# Altium schematic sheet Motor.SchDoc
size A4; SheetNumber: 3; SheetTotal: 4
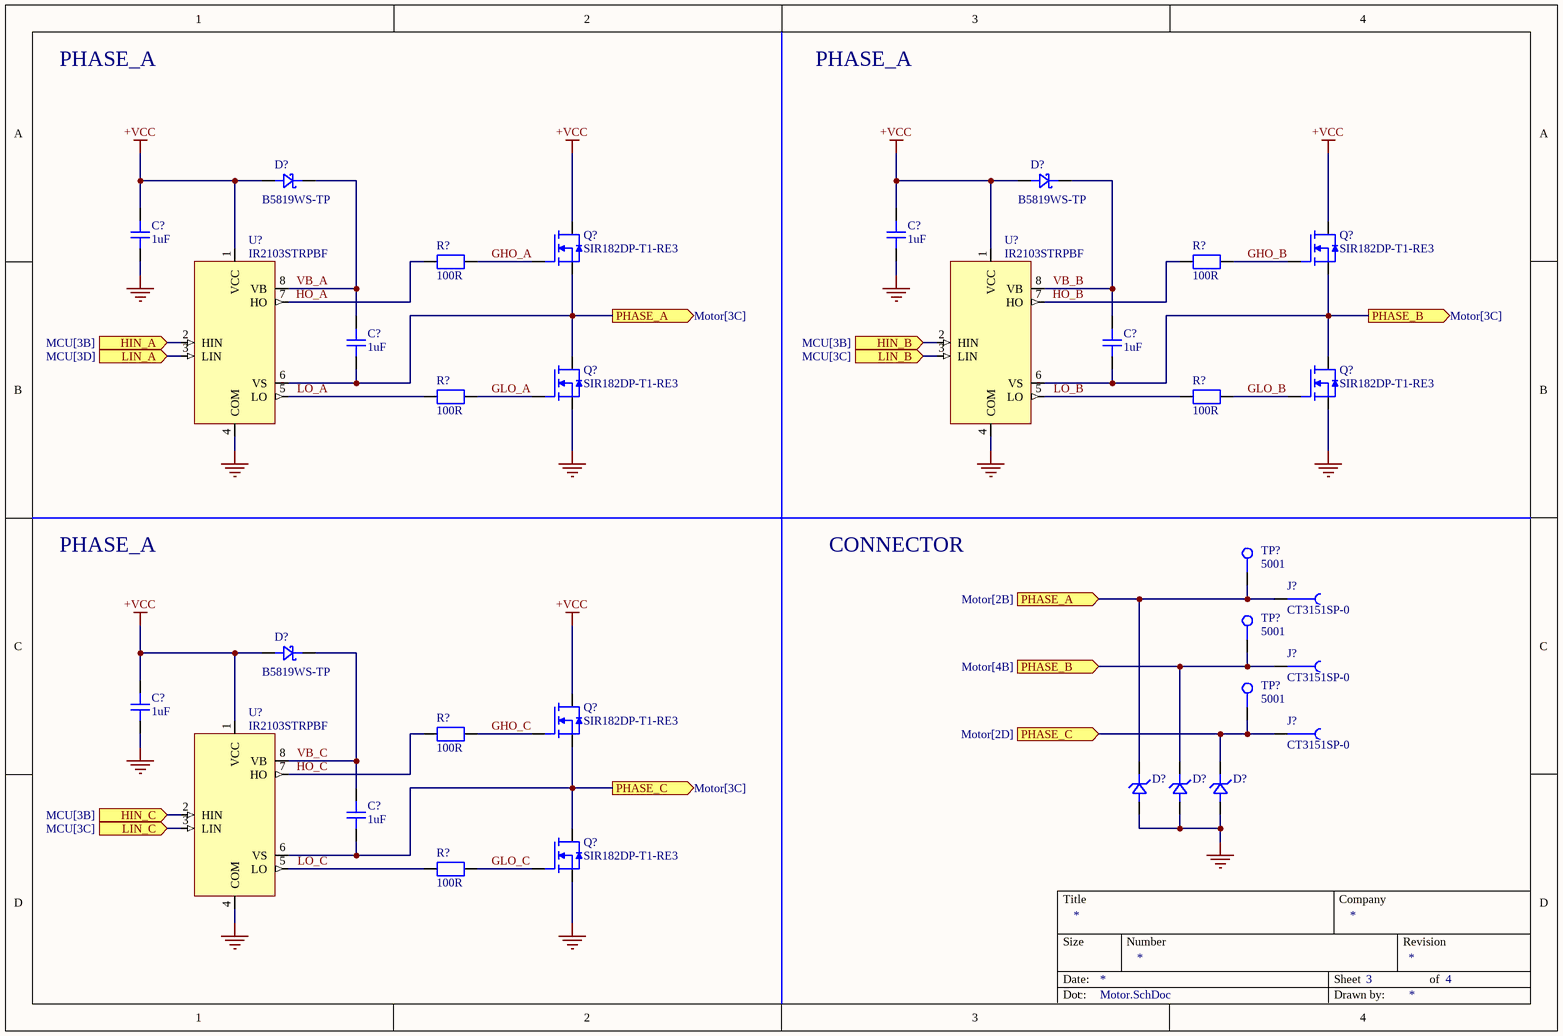
[diagram p0: Motor.SchDoc]

## Parts
(Parts that share a designator on the sheet are numbered #1, #2 ... from top to bottom, then left to right.)
C?#1  value 1uF  [C_Yageo_CC_0603_A]  (hidden comment: CC0603KRX7R7BB105)
C?#2  value 1uF  [C_Yageo_CC_0603_A]  (hidden comment: CC0603KRX7R7BB105)
C?#3  value 1uF  [C_Yageo_CC_0603_A]  (hidden comment: CC0603KRX7R7BB105)
C?#4  value 1uF  [C_Yageo_CC_0603_A]  (hidden comment: CC0603KRX7R7BB105)
C?#5  value 1uF  [C_Yageo_CC_0603_A]  (hidden comment: CC0603KRX7R7BB105)
C?#6  value 1uF  [C_Yageo_CC_0603_A]  (hidden comment: CC0603KRX7R7BB105)
D?#1  B5819WS-TP  [D_Schottky_Micro_SOD-323]
D?#2  B5819WS-TP  [D_Schottky_Micro_SOD-323]
D?#3  B5819WS-TP  [D_Schottky_Micro_SOD-323]
D?#4  D5V0F1U2S9-7  [D_TVS_Uni_Diodes_SOD-923_B]  (value not drawn)
D?#5  D5V0F1U2S9-7  [D_TVS_Uni_Diodes_SOD-923_B]  (value not drawn)
D?#6  D5V0F1U2S9-7  [D_TVS_Uni_Diodes_SOD-923_B]  (value not drawn)
J?#1  CT3151SP-0  [J_CalTest_CT3151SP-0]
J?#2  CT3151SP-0  [J_CalTest_CT3151SP-0]
J?#3  CT3151SP-0  [J_CalTest_CT3151SP-0]
Q?#1  SIR182DP-T1-RE3  [Q_Vishay_PowerPACK-SO-8-Single]
Q?#2  SIR182DP-T1-RE3  [Q_Vishay_PowerPACK-SO-8-Single]
Q?#3  SIR182DP-T1-RE3  [Q_Vishay_PowerPACK-SO-8-Single]
Q?#4  SIR182DP-T1-RE3  [Q_Vishay_PowerPACK-SO-8-Single]
Q?#5  SIR182DP-T1-RE3  [Q_Vishay_PowerPACK-SO-8-Single]
Q?#6  SIR182DP-T1-RE3  [Q_Vishay_PowerPACK-SO-8-Single]
R?#1  value 100R  [R_Yageo_RCL_1206_A]  (hidden comment: RC1206FR-07100RL)
R?#2  value 100R  [R_Yageo_RCL_1206_A]  (hidden comment: RC1206FR-07100RL)
R?#3  value 100R  [R_Yageo_RCL_1206_A]  (hidden comment: RC1206FR-07100RL)
R?#4  value 100R  [R_Yageo_RCL_1206_A]  (hidden comment: RC1206FR-07100RL)
R?#5  value 100R  [R_Yageo_RCL_1206_A]  (hidden comment: RC1206FR-07100RL)
R?#6  value 100R  [R_Yageo_RCL_1206_A]  (hidden comment: RC1206FR-07100RL)
TP?#1  5001  [TP_Keystone_TH]
TP?#2  5001  [TP_Keystone_TH]
TP?#3  5001  [TP_Keystone_TH]
U?#1  IR2103STRPBF  [U_Infineon_8-SOIC_3.9mm]
U?#2  IR2103STRPBF  [U_Infineon_8-SOIC_3.9mm]
U?#3  IR2103STRPBF  [U_Infineon_8-SOIC_3.9mm]

## Ports
HIN_A (in, see MCU[3B]), HIN_B (in, see MCU[3B]), HIN_C (in, see MCU[3B]), LIN_A (in, see MCU[3D]), LIN_B (in, see MCU[3C]), LIN_C (in, see MCU[3C]), PHASE_A (in, see Motor[2B]), PHASE_A (out, see Motor[3C]), PHASE_B (in, see Motor[4B]), PHASE_B (out, see Motor[3C]), PHASE_C (in, see Motor[2D]), PHASE_C (out, see Motor[3C])

## Nets
+VCC: C?#1.2 C?#2.2 C?#5.2 D?#1.2 D?#2.2 D?#3.2 Q?#1.1(D) Q?#2.1(D) Q?#5.1(D) U?#1.1(VCC) U?#2.1(VCC) U?#3.1(VCC)
GND: C?#1.1 C?#2.1 C?#5.1 D?#4.2 D?#5.2 D?#6.2 Q?#3.3(S) Q?#4.3(S) Q?#6.3(S) U?#1.4(COM) U?#2.4(COM) U?#3.4(COM)
GHO_A: Q?#1.2(G) R?#1.2
GHO_B: Q?#2.2(G) R?#2.2
GHO_C: Q?#5.2(G) R?#5.2
GLO_A: Q?#3.2(G) R?#3.2
GLO_B: Q?#4.2(G) R?#4.2
GLO_C: Q?#6.2(G) R?#6.2
HIN_A: U?#1.2(HIN) ; port HIN_A
HIN_B: U?#2.2(HIN) ; port HIN_B
HIN_C: U?#3.2(HIN) ; port HIN_C
HO_A: R?#1.1 U?#1.7(HO)
HO_B: R?#2.1 U?#2.7(HO)
HO_C: R?#5.1 U?#3.7(HO)
LIN_A: U?#1.3(LIN) ; port LIN_A
LIN_B: U?#2.3(LIN) ; port LIN_B
LIN_C: U?#3.3(LIN) ; port LIN_C
LO_A: R?#3.1 U?#1.5(LO)
LO_B: R?#4.1 U?#2.5(LO)
LO_C: R?#6.1 U?#3.5(LO)
PHASE_A: C?#3.1 D?#4.1 J?#1.1 Q?#1.3(S) Q?#3.1(D) TP?#1.1 U?#1.6(VS) ; port PHASE_A
PHASE_B: C?#4.1 D?#5.1 J?#2.1 Q?#2.3(S) Q?#4.1(D) TP?#2.1 U?#2.6(VS) ; port PHASE_B
PHASE_C: C?#6.1 D?#6.1 J?#3.1 Q?#5.3(S) Q?#6.1(D) TP?#3.1 U?#3.6(VS) ; port PHASE_C
VB_A: C?#3.2 D?#1.1 U?#1.8(VB)
VB_B: C?#4.2 D?#2.1 U?#2.8(VB)
VB_C: C?#6.2 D?#3.1 U?#3.8(VB)

## Notes on the sheet
- PHASE_A
- CONNECTOR
- Title
- Company
- Size
- Date:
- Number
- Sheet
- Revision
- of
- Doc:
- Drawn by:

## Library data of the parts
C?#1-C?#6 = CMP-001-00019-1: Multilayer Ceramic Capacitor, 1 uF, 16 V, ± 10%, X7R, 0603 [1608 Metric]; Voltage: 16V; Dissipation Factor: 5%; Case Code (Imperial): 0603; ComponentLink1URL: https://www.yageo.com/upload/media/product/productsearch/datasheet/mlcc/UPY-GPHC_X7R_6.3V-to-250V_24.pdf; Pins: 2; Width: 0.031inch; Tolerance: 10%; Height: 0.8mm; Radiation Hardening: No; Lead Free: Lead Free; Material: Ceramic; Reach SVHC Compliant: Unknown; Case Code (Metric): 1608; Min Operating Temperature: -55°C; Case/Package: 0603; Package Quantity: 1; Thickness: 0.035inch; Packaging: Tape and Reel; Series: CC; Termination: SMD/SMT; Max Operating Temperature: 125°C; Construction: Flat; Depth: 0.8mm; Halogen Free: Halogen Free; RoHS Compliant: Yes; Voltage Rating (DC): 16V; Dielectric: X7R; Length: 1.6mm; Voltage Rating: 16V; Mounting Technology: Surface Mount; ComponentLink1Description: Datasheet
D?#1-D?#3 = CMP-004-00004-1: Rectifier Diode, Schottky, 1 Phase, 1 Element, 1A, 40V V(RRM), Silicon; Peak Non-Repetitive Surge Current: 10A; Value: 48pF; Max Reverse Leakage Current: 1mA; Forward Voltage: 900mV; Max Reverse Current: 7uA; Reverse Voltage: 40V; Max Reverse Voltage (DC): 40V; Max Surge Current: 10A; Packaging: Tape and Reel; ComponentLink1Description: Datasheet; Max Operating Temperature: 125°C; Height: 1.15mm; Lead Free: Lead Free; Mounting Technology: Surface Mount; RoHS Compliant: Yes; Forward Current: 1A; Average Rectified Current: 1A; Pins: 2; Max Forward Surge Current (Ifsm): 10A; Radiation Hardening: No; Series: -; Min Operating Temperature: -65°C; ComponentLink1URL: https://www.mccsemi.com/pdf/Products/B5817WS-B5819WS(SOD-323).PDF
D?#4-D?#6 = CMP-004-00003-1: Diode TVS Dual Uni-Dir 5.5V 250000W 2-Pin SOD-923 T/R; Max Power Dissipation: 250mW; ESD Protection: Yes; Max Reverse Leakage Current: 100nA; Capacitance: 0.5pF @ 1MHz; Max Surge Current: 1.5A; Diode Type: ZENER; Direction: Unidirectional; Breakdown Voltage: 6V; Clamping Voltage: 10V; Value: 5E-13F; Peak Pulse Power: 250kW; Number of Unidirectional Channels: 1; ComponentLink1Description: Datasheet; Working Voltage: 5.5V; Reverse Standoff Voltage: 5.5V; Case/Package: SOD-923-2; Max Operating Temperature: 150°C; Power Line Protection: Yes; Mounting Technology: Surface Mount; Peak Pulse Current: 1.5A; Packaging: Tape and Reel; RoHS Compliant: Yes; Package Quantity: 10000; Contact Plating: Tin,Matte; Series: -; Termination: SMD/SMT; Polarity: Unidirectional; Min Breakdown Voltage: 6V; Min Operating Temperature: -65°C; ComponentLink1URL: https://www.diodes.com/assets/Datasheets/D5V0F1U2S9.pdf
J?#1-J?#3 = CMP-002-00000-11: Conn 4mm Safety Banana Jack F 1 POS Solder RA Thru-Hole 1 Port Bag; pin to pad: 1>1+2+3+4; Gender: Female; Insulation: Mating End Insulated; Body Material: Nylon,Polyamide,PA66; Series: Cal Test; Max Operating Temperature: 80°C; Termination: Solder; ComponentLink1URL: https://mm.digikey.com/Volume0/opasdata/d220001/medias/docus/4846/DS_1768_Catalog.pdf; ComponentLink1Description: Datasheet; Contact Plating: Nickel; Mounting Technology: Through Hole,Panel; Min Operating Temperature: -20°C; Contact Material: Brass; Packaging: Bulk; Color: Black
Q?#1-Q?#6 = CMP-013-00000-2: TrenchFET Gen IV Power MOSFET N-Channel Single 60V VDS ±20V VGS 60A ID 8-Pin PowerPAK SOIC T/R; pin to pad: 1>5 2>4 3>1+2+3; Rds On Max: 2.8mR; Max Power Dissipation: 69.4W; Input Capacitance: 3.25nF; Continuous Drain Current (ID): 60A; Max Operating Temperature: 150°C; Mounting Technology: Surface Mount; ComponentLink1URL: https://www.vishay.com/docs/77800/sir182dp.pdf; ComponentLink1Description: Datasheet; Drain to Source Voltage (Vdss): 60V; Packaging: Cut Tape; Series: TrenchFET® Gen IV; Min Operating Temperature: -55°C
R?#1-R?#6 = CMP-009-00004-8: SMD Chip Resistor, 100 Ohm, ± 1%, 250 mW, 1206 [3216 Metric], Thick Film, General Purpose; Max Power Dissipation: 250mW; Voltage Rating (AC): 200V; Temperature Coefficient: 100ppm/°C; Series: RC; Tolerance: 1%; Width: 1.6mm; Lead Free: Lead Free; Number of Terminations: 2; Termination: SMD/SMT; Case/Package: 1206; Height: 0.55mm; Case Code (Metric): 3216; Reach SVHC Compliant: Unknown; ComponentLink1Description: Datasheet; Technology: THICK FILM; Voltage Rating: 200V; Features: Moisture Resistant; Power Rating: 250mW; Min Operating Temperature: -55°C; Package Quantity: 5000; RoHS Compliant: Yes; Packaging: Tape and Reel; Depth: 1.6mm; Length: 3.1mm; Resistance Tolerance: 1%; Max Operating Temperature: 155°C; Case Code (Imperial): 1206; ComponentLink1URL: https://www.yageo.com/upload/media/product/products/datasheet/rchip/PYu-RC_Group_51_RoHS_L_12.pdf; Resistor Type: Thick Film
TP?#1-TP?#3 = CMP-000000-1: TEST POINT, PCB, THROUGH HOLE; Product R; Range: -; Connector Colour: Black; Mounting: Through Hole; Body Material: Bronze; Insulation: Insulated; Plating: Silver; Number of Ports: 1; Inside Diameter: 1.27mm; Hole Diameter: 1.6mm; Outside Diameter: 2.54mm; Lead Free: Lead Free; Series: THM; Mounting Technology: Through Hole; Material: Nylon,Bronze,Silver; Color: Black; Packaging: Bulk; ComponentLink1URL: https://www.keyelco.com/userAssets/file/M65p56.pdf; Housing Color: Black; Reach SVHC Compliant: No; ComponentLink1Description: Datasheet; RoHS Compliant: Yes; Termination: Through Hole; Contact Plating: Tin,Silver; Diameter: 2.54mm; Insulation Material: Nylon; Contact Material: Bronze; Orientation: Straight; Number of Contacts: 1; Length: 7.62mm; Package Quantity: 100
U?#1-U?#3 = CMP-024-00000-2: 600 V half-bridge gate driver IC with shoot through protection, SOIC 8N, RoHS; Number of Outputs: 2; Max Supply Voltage: 20V; Propagation Delay: 680ns; Fall Time: 60ns; Channel Type: Independent; Output Current: 360mA; Mounting Technology: Surface Mount; Case/Package: SOIC; ComponentLink1Description: Datasheet; ComponentLink1URL: https://www.infineon.com/dgdl/ir2103.pdf?fileId=5546d462533600a4015355c7b54b166f; Width: 0.157inch; Halogen Free: Not Halogen Free; Height: 0.059inch; Number of Channels: 2; Series: -; Pins: 8; Lead Free: Lead Free; Length: 0.196inch; RoHS Compliant: Yes; Max Operating Temperature: 150°C; Number of Drivers: 2; Min Operating Temperature: -40°C; Max Output current: 360mA; Packaging: Cut Tape